# EAGLE design usbasp (EAGLE 6.2)
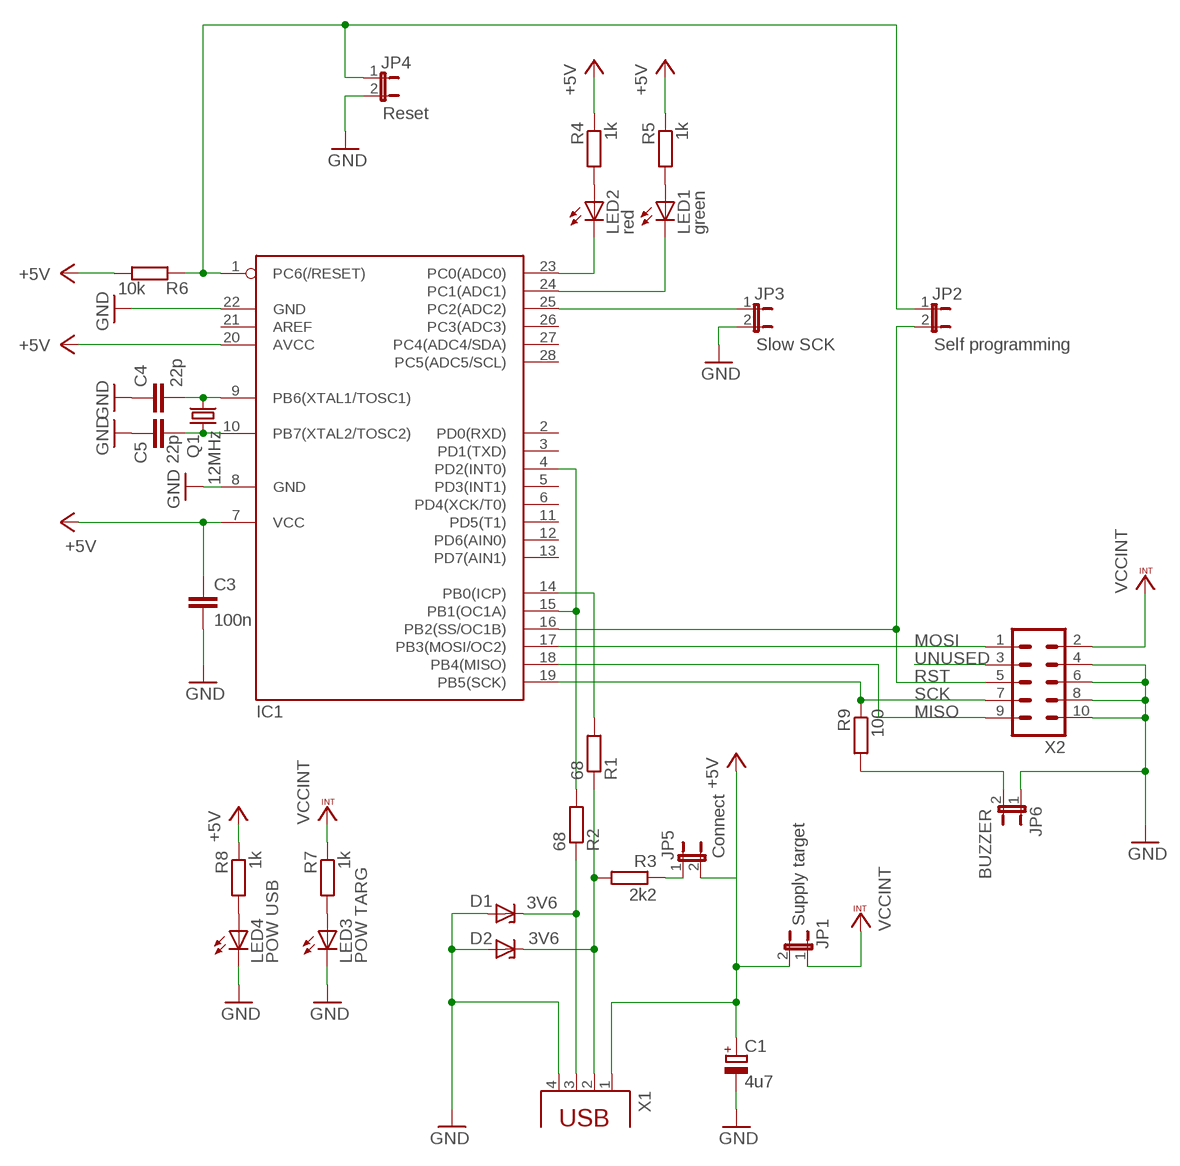
[diagram p0: schematic, sheet 1]

## Parts
C1  4u7  CPOL-EUTT6D6  [TT5D6]
C3  100n  C-EU025-024X044  [C025-024X044]
C4  22p  C-EU025-024X044  [C025-024X044]
C5  22p  C-EU050-025X075  [C050-025X075]
D1  3V6  ZENER-DIODEDO34-7  [DO34Z7]
D2  3V6  ZENER-DIODEZD-5  [ZDIO-5]
IC1  MEGA8-P  [DIL28-3]
JP1  Supply target  JP1E  [JP1]
JP2  Self programming  JP1E  [JP1]
JP3  Slow SCK  JP1E  [JP1]
JP4  Reset  JP1E  [JP1]
JP5  Connect  JP1E  [JP1]
JP6  BUZZER  JP1E  [JP1]
LED1  green  LED3MM  [LED3MM]
LED2  red  LED3MM  [LED3MM]
LED3  POW TARG  LED3MM  [LED3MM]
LED4  POW USB  LED3MM  [LED3MM]
Q1  12MHz  CRYSTALTC26V  [TC26V]
R1  68  R-EU_R1206  [R1206]
R2  68  R-EU_0204/2V  [0204V]
R3  2k2  R-EU_0617/17  [0617/17]
R4  1k  R-EU_0204/5  [0204/5]
R5  1k  R-EU_0207/12  [0207/12]
R6  10k  R-EU_0207/15  [0207/15]
R7  1k  R-EU_0204/2V  [0204V]
R8  1k  R-EU_0204/5  [0204/5]
R9  100  R-EU_0207/15  [0207/15]
X1  PN61729  [PN61729]
X2  ML10L  [ML10L]

## Nets
MISO: IC1.18(PB4(MISO)) X2.9
MOSI: IC1.17(PB3(MOSI/OC2)) X2.1
N$1: LED3.A R7.2
N$2: D1.C R2.1 X1.3
N$3: C1.+ C3.1 IC1.7(VCC) IC1.20(AVCC) JP1.2 JP5.2 R4.1 R5.1 R6.1 R8.1 X1.1 ; supply symbol labelled +5V
N$4: LED4.A R8.2
N$5: D2.C R1.1 R3.2 X1.2
N$6: JP5.1 R3.1
N$7: IC1.4(PD2(INT0)) IC1.15(PB1(OC1A)) R2.2
N$8: JP6.2 R9.2
N$10: C1.- C3.2 C4.1 C5.1 D1.A D2.A IC1.8(GND) IC1.22(GND) JP3.2 JP4.2 JP6.1 LED3.K(C) LED4.K(C) X1.4 X2.4 X2.6 X2.8 X2.10 ; supply symbol labelled GND
N$11: IC1.1(PC6(/RESET)) JP2.1 JP4.1 R6.2
N$12: IC1.25(PC2(ADC2)) JP3.1
N$13: LED2.A R4.2
N$14: IC1.23(PC0(ADC0)) LED2.K(C)
N$15: IC1.24(PC1(ADC1)) LED1.K(C)
N$16: IC1.14(PB0(ICP)) R1.2
N$22: C4.2 IC1.9(PB6(XTAL1/TOSC1)) Q1.2
N$23: C5.2 IC1.10(PB7(XTAL2/TOSC2)) Q1.1
N$25: LED1.A R5.2
RST: IC1.16(PB2(SS/OC1B)) JP2.2 X2.5
SCK: IC1.19(PB5(SCK)) R9.1 X2.7
UNUSED: X2.3
VCCINT: JP1.1 R7.1 X2.2
Unconnected: IC1.2(PD0(RXD)) IC1.3(PD1(TXD)) IC1.5(PD3(INT1)) IC1.6(PD4(XCK/T0)) IC1.11(PD5(T1)) IC1.12(PD6(AIN0)) IC1.13(PD7(AIN1)) IC1.21(AREF) IC1.26(PC3(ADC3)) IC1.27(PC4(ADC4/SDA)) IC1.28(PC5(ADC5/SCL))

## Library data of the parts
C1 = rcl:CPOL-EU: POLARIZED CAPACITOR, European symbol
C3-C5 = rcl:C-EU: CAPACITOR, European symbol
D1 D2 = diode:ZENER-DIODE: Z-Diode
IC1 = atmel:MEGA8-P: MICROCONTROLLER 8 Kbytes FLASH, 1 kbytes SRAM, 512 bytes EEPROM, USART, 4-channel 10 bit ADC, 2-channel 8 bit ADC Pin compatible with Atmega48, ATMega88, ATMega168 Source: avr.lbr
JP1-JP6 = jumper:JP1E: JUMPER
LED1-LED4 = led:LED: LED OSRAM: - CHIPLED LG R971, LG N971, LY N971, LG Q971, LY Q971, LO R971, LY R971 LH N974, LH R974 LS Q976, LO Q976, LY Q976 LO Q996 - Hyper CHIPLED LW Q18S LB Q993, LB Q99A, LB R99A - SideLED LS A670, LO A670, LY A670, LG A670, LP A670 LB A673, LV A673, LT A673, LW A673 LH A674 LY A675 LS A676, LA A676, LO A676, LY A676, LW A676 LS A679, LY A679, LG A679 - Hyper Micro SIDELED® LS Y876, LA Y876, LO Y876, LY Y876 LT Y87S - SmartLED LW L88C, LW L88S LB L89C, LB L89S, LG L890 LS L89K, LO L89K, LY L89K LS L896, LA L896, LO L896, LY L896 - TOPLED LS T670, LO T670, LY T670, LG T670, LP T670 LSG T670, LSP T670, LSY T670, LOP T670, LYG T670 LG T671, LOG T671, LSG T671 LB T673, LV T673, LT T673, LW T673 LH T674 LS T676, LA T676, LO T676, LY T676, LB T676, LH T676, LSB T676, LW T676 LB T67C, LV T67C, LT T67C, LS T67K, LO T67K, LY T67K, LW E67C LS E67B, LA E67B, LO E67B, LY E67B, LB E67C, LV E67C, LT E67C LW T67C LS T679, LY T679, LG T679 LS T770, LO T770, LY T770, LG T770, LP T770 LB T773, LV T773, LT T773, LW T773 LH T774 LS E675, LA E675, LY E675, LS T675 LS T776, LA T776, LO T776, LY T776, LB T776 LHGB T686 LT T68C, LB T68C - Hyper Mini TOPLED® LB M676 - Mini TOPLED Santana® LG M470 LS M47K, LO M47K, LY M47K Source: http://www.osram.convergy.de LUXEON: - LUMILED® LXK2-PW12-R00, LXK2-PW12-S00, LXK2-PW14-U00, LXK2-PW14-V00 LXK2-PM12-R00, LXK2-PM12-S00, LXK2-PM14-U00 LXK2-PE12-Q00, LXK2-PE12-R00, LXK2-PE12-S00, LXK2-PE14-T00, LXK2-PE14-U00 LXK2-PB12-K00, LXK2-PB12-L00, LXK2-PB12-M00, LXK2-PB14-N00, LXK2-PB14-P00, LXK2-PB14-Q00 LXK2-PR12-L00, LXK2-PR12-M00, LXK2-PR14-Q00, LXK2-PR14-R00 LXK2-PD12-Q00, LXK2-PD12-R00, LXK2-PD12-S00 LXK2-PH12-R00, LXK2-PH12-S00 LXK2-PL12-P00, LXK2-PL12-Q00, LXK2-PL12-R00 Source: www.luxeon.com KINGBRIGHT: KA-3528ASYC Source: www.kingbright.com
Q1 = crystal:CRYSTAL: CRYSTAL
R1-R9 = rcl:R-EU_: RESISTOR, European symbol
X1 = con-berg:PN61729: BERG USB connector
X2 = con-harting-ml:ML10: HARTING

## Board
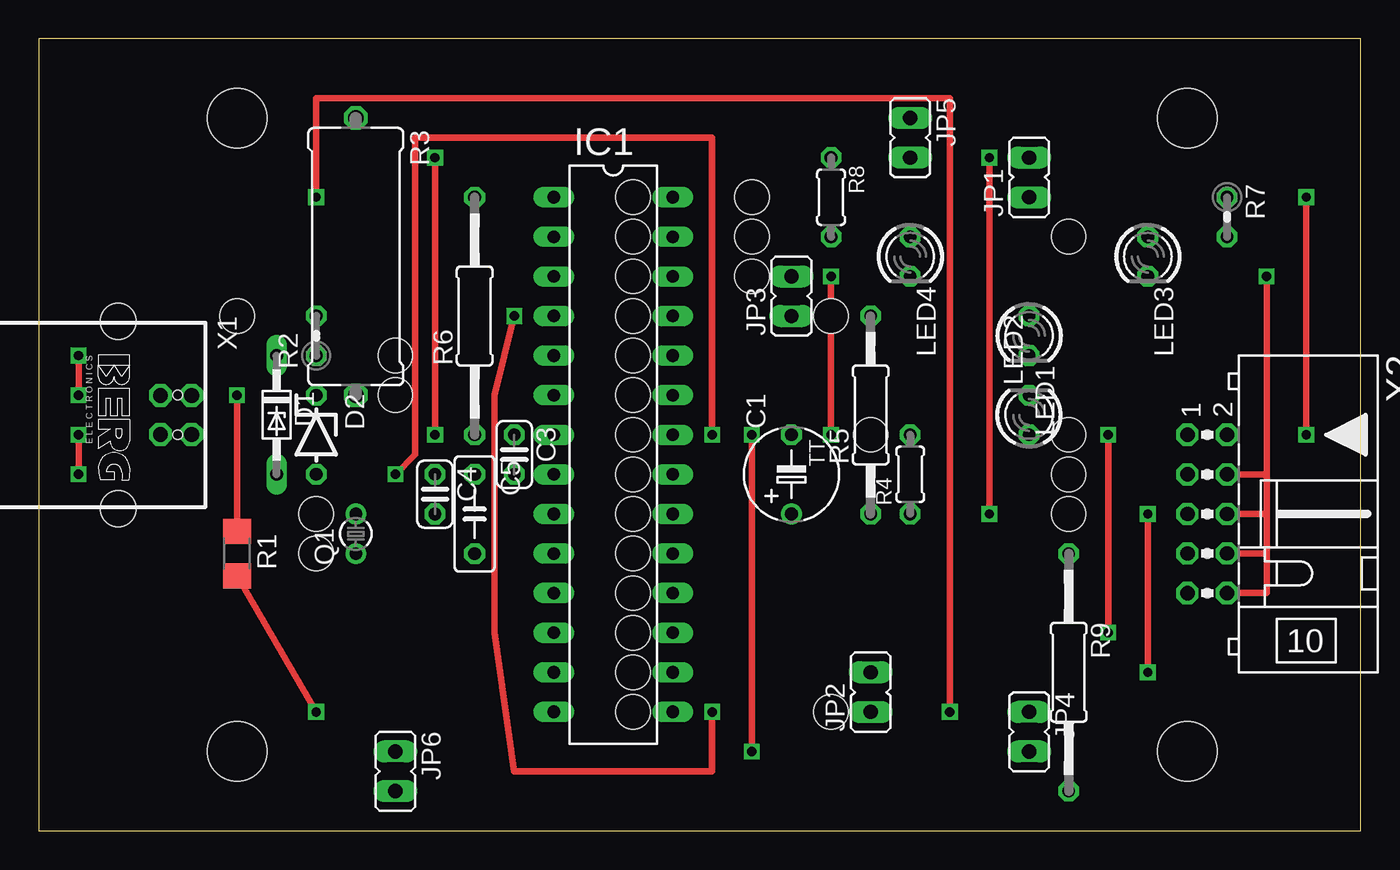
[diagram p1: board, top side]
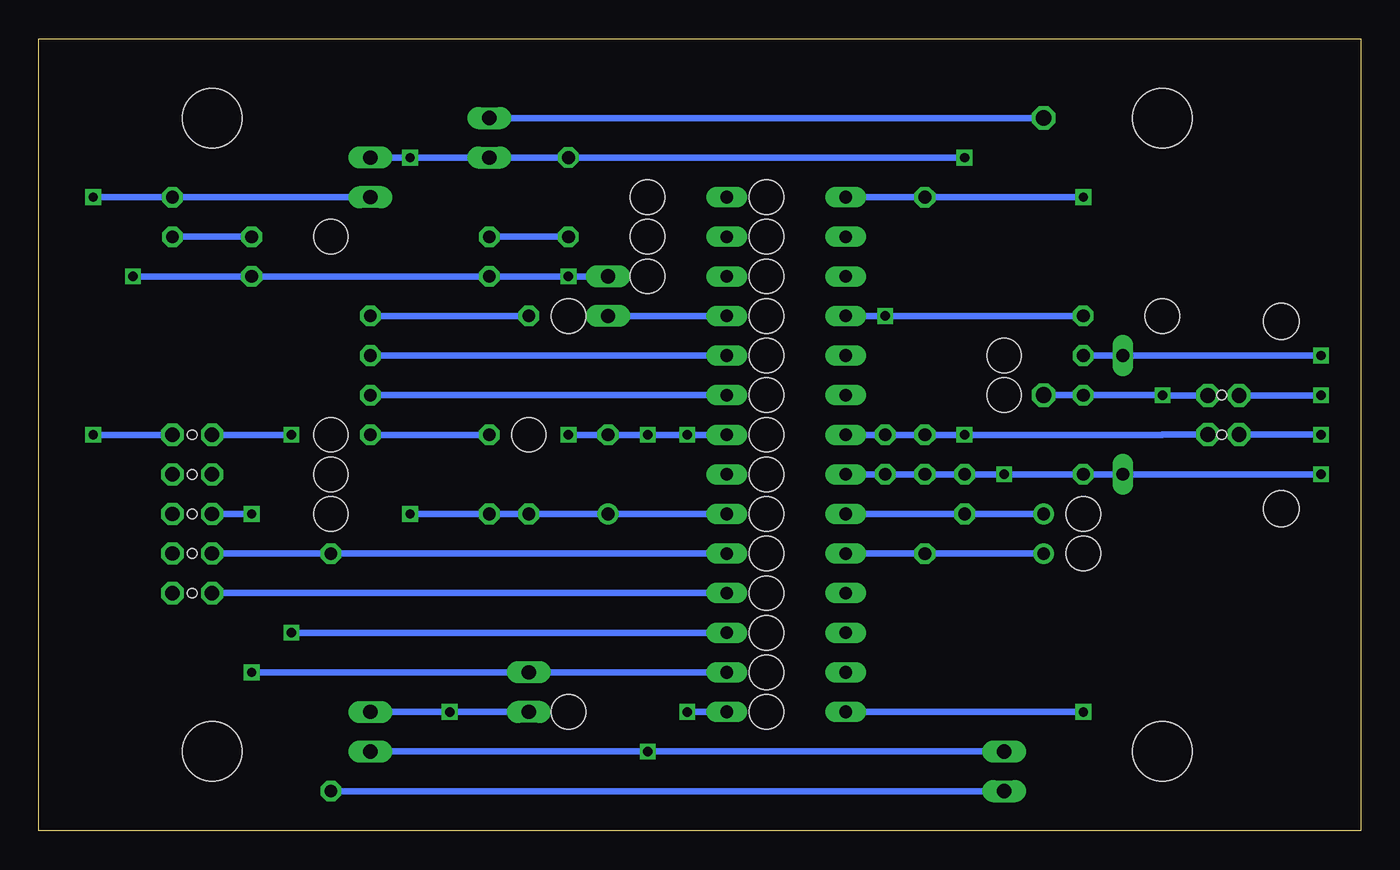
[diagram p2: board, bottom side, seen from below]

Size 84.76 x 50.79 mm. Coordinates in mm from the lower left corner, seen from the top.
Outline: 0,0 84.76,0 84.76,50.79 0,50.79 0,0
Copper layers (1*16): Top 0.035mm / dielectric 1.5mm / Bottom 0.035mm
Design rules: minimum track width 10mil, minimum drill 24mil, track to track 8mil, track to pad 8mil, pad to pad 8mil, via to via 8mil, smd to smd 8mil, copper to edge 40mil, drill to drill 8mil, minimum pad ring 10mil, minimum via ring 8mil, stop-mask expansion 4mil, vias tented up to drill 0mil, thermal gap 10mil
Holes 2.2 mm at 22.86,30.48 22.86,27.94 66.04,20.32 50.8,7.62 66.04,25.4 66.04,22.86 45.72,35.56 50.8,33.02 53.34,25.4 45.72,38.1 66.04,38.1 38.1,40.64 38.1,38.1 38.1,35.56 38.1,33.02 38.1,30.48 38.1,27.94 38.1,25.4 38.1,22.86 38.1,20.32 38.1,17.78 38.1,15.24 38.1,12.7 38.1,10.16 38.1,7.62 45.72,40.64 17.78,20.32 17.78,17.78 12.7,33.02
Holes 0.6 mm at 8.89,25.4 8.89,27.94 74.93,25.4 74.93,22.86 74.93,20.32 74.93,17.78 74.93,15.24
Holes 3.81 mm at 12.7,45.72 12.7,5.08 73.66,45.72 73.66,5.08

### Footprints (pad centres in the part's own frame; a part is rotated, then mirrored left to right if it is on the bottom)
TT5D6 = drill 0.813: + -2.54,0 | drill 0.813 octagon: - 2.54,0
C025-024X044 = drill 0.813 octagon: 1 -1.27,0; 2 1.27,0
C050-025X075 = drill 0.813 octagon: 1 -2.54,0; 2 2.54,0
DO34Z7 = drill 0.813 long: A 3.81,0; C -3.81,0
ZDIO-5 = drill 0.813 octagon: A 2.54,0; C -2.54,0
DIL28-3 = drill 0.813 long: 1 -16.51,-3.81; 2 -13.97,-3.81; 3 -11.43,-3.81; 4 -8.89,-3.81; 5 -6.35,-3.81; 6 -3.81,-3.81; 7 -1.27,-3.81; 8 1.27,-3.81; 9 3.81,-3.81; 10 6.35,-3.81; 11 8.89,-3.81; 12 11.43,-3.81; 13 13.97,-3.81; 14 16.51,-3.81; 15 16.51,3.81; 16 13.97,3.81; 17 11.43,3.81; 18 8.89,3.81; 19 6.35,3.81; 20 3.81,3.81; 21 1.27,3.81; 22 -1.27,3.81; 23 -3.81,3.81; 24 -6.35,3.81; 25 -8.89,3.81; 26 -11.43,3.81; 27 -13.97,3.81; 28 -16.51,3.81
JP1 = drill 0.914 long: 1 0,-1.27; 2 0,1.27
LED3MM = drill 0.813 octagon: A -1.27,0; K 1.27,0
TC26V = drill 0.813: 1 -1.27,0; 2 1.27,0
R1206 = smd 1.6 x 1.803: 1 -1.422,0; 2 1.422,0
0204V = drill 0.813 octagon: 1 -1.27,0; 2 1.27,0
0617/17 = drill 1.016 octagon: 1 -8.89,0; 2 8.89,0
0204/5 = drill 0.813 octagon: 1 -2.54,0; 2 2.54,0
0207/12 = drill 0.813 octagon: 1 -6.35,0; 2 6.35,0
0207/15 = drill 0.813 octagon: 1 -7.62,0; 2 7.62,0
PN61729 = drill 0.95 octagon: 1 1.25,4.71; 2 -1.25,4.71; 3 -1.25,2.71; 4 1.25,2.71 | hole 2.3: -6.02,0; 6.02,0
ML10L = drill 0.914 octagon: 1 -5.08,-1.27; 2 -5.08,1.27; 3 -2.54,-1.27; 4 -2.54,1.27; 5 0,-1.27; 6 0,1.27; 7 2.54,-1.27; 8 2.54,1.27; 9 5.08,-1.27; 10 5.08,1.27

### Placement (x,y rotation side)
C1  48.26,22.86 90 top
C3  30.48,24.13 270 top
C4  25.4,21.59 270 top
C5  27.94,20.32 270 top
D1  15.24,26.67 270 top
D2  17.78,25.4 270 top
IC1  36.83,24.13 270 top
JP1  63.5,41.91 0 top
JP2  53.34,8.89 0 top
JP3  48.26,34.29 0 top
JP4  63.5,6.35 180 top
JP5  55.88,44.45 180 top
JP6  22.86,3.81 180 top
LED1  63.5,31.75 270 top
LED2  63.5,26.67 90 top
LED3  71.12,36.83 270 top
LED4  55.88,36.83 270 top
Q1  20.32,19.05 90 top
R1  12.7,17.78 270 top
R2  17.78,31.75 90 top
R3  20.32,36.83 270 top
R4  55.88,22.86 90 top
R5  53.34,26.67 90 top
R6  27.94,33.02 90 top
R7  76.2,39.37 270 top
R8  50.8,40.64 270 top
R9  66.04,10.16 270 top
X1  5.08,26.67 270 top
X2  74.93,20.32 270 top

### Tracks (layer width: path | path; a pad name or v marks a point on that pad's centre or on a via)
MISO
  Bottom 0.406: IC1.18 X2.9
MOSI  (via drill 0.6)
  Top 0.406: v68.58,12.7 v68.58,25.4
  Bottom 0.406: v68.58,25.4 X2.1 | IC1.17 v68.58,12.7
N$1
  Bottom 0.406: LED3.A R7.2
N$2  (via drill 0.6)
  Top 0.406: v2.54,27.94 v2.54,30.48
  Bottom 0.406: R2.1 D1.C v2.54,30.48 | X1.3 2.54,27.92 v2.54,27.94
N$3  (via drill 0.6)
  Top 0.406: v60.96,43.18 v60.96,20.32 | v25.4,25.4 v25.4,43.18
  Bottom 0.406: C3.1 IC1.7 R6.1 v25.4,25.4 12.7,25.4 12.7,25.42 X1.1 | IC1.20 C1.+ R5.1 R4.1 v60.96,20.32 | JP1.2 v60.96,43.18 JP5.2 R8.1 v25.4,43.18
N$4
  Bottom 0.406: R8.2 LED4.A
N$5  (via drill 0.6)
  Top 0.406: R1.1 v12.7,27.94
  Bottom 0.406: D2.C R3.2 | D2.C 12.7,27.92 X1.2 | v12.7,27.94 D2.C
N$6
  Bottom 0.406: R3.1 JP5.1
N$7  (via drill 0.6)
  Top 0.406: v43.18,7.62 43.18,3.81 30.48,3.81 29.21,12.7 29.21,27.94 v30.48,33.02
  Bottom 0.406: IC1.4 v30.48,33.02 R2.2 | v43.18,7.62 IC1.15
N$8
  Bottom 0.406: JP6.2 R9.2
N$10  (via drill 0.6)
  Top 0.406: v43.18,25.4 43.18,44.45 24.13,44.45 24.13,24.13 v22.86,22.86 | v2.54,22.86 v2.54,25.4 | 78.74,22.86 X2.4 | 78.74,22.86 78.74,20.32 | 78.74,20.32 X2.6 | 78.74,20.32 78.74,17.78 | 78.74,17.78 X2.8 | 78.74,17.78 78.74,15.24 X2.10 | v50.8,25.4 v50.8,35.56 | v78.74,35.56 78.74,22.86 | v45.72,25.4 v45.72,5.08
  Bottom 0.406: 2.54,25.42 2.54,25.43 | C3.2 IC1.8 C5.1 C4.1 v22.86,22.86 D2.A D1.A v2.54,22.86 | IC1.22 v43.18,25.4 v45.72,25.4 C1.- v50.8,25.4 | JP3.2 v50.8,35.56 LED4.K LED3.K v78.74,35.56 | 2.54,25.42 X1.4 | v2.54,25.4 2.54,25.42 | JP4.2 v45.72,5.08 JP6.1
N$11  (via drill 0.6)
  Top 0.406: v17.78,40.64 17.78,46.99 58.42,46.99 v58.42,7.62
  Bottom 0.406: IC1.1 R6.2 v17.78,40.64 | JP2.1 v58.42,7.62 JP4.1
N$12
  Bottom 0.406: IC1.25 JP3.1
N$13
  Bottom 0.406: R4.2 LED2.A
N$14
  Bottom 0.406: IC1.23 LED2.K
N$15
  Bottom 0.406: IC1.24 LED1.K
N$16  (via drill 0.6)
  Top 0.406: v17.78,7.62 R1.2
  Bottom 0.406: v17.78,7.62 IC1.14
N$22
  Bottom 0.406: Q1.2 C4.2 IC1.9
N$23
  Bottom 0.406: IC1.10 C5.2 Q1.1
N$25
  Bottom 0.406: R5.2 LED1.A
RST  (via drill 0.6)
  Top 0.406: v71.12,10.16 v71.12,20.32
  Bottom 0.406: IC1.16 v71.12,10.16 JP2.2 | v71.12,20.32 X2.5
SCK
  Bottom 0.406: IC1.19 R9.1 X2.7
VCCINT  (via drill 0.6)
  Top 0.406: v81.28,25.4 v81.28,40.64
  Bottom 0.406: X2.2 v81.28,25.4 | JP1.1 R7.1 v81.28,40.64

### Text on the board
Document: SCK | MISO | MOSI | RST | GND